# Altium schematic sheet 07-AUDIO_MAIN.SchDoc
size C
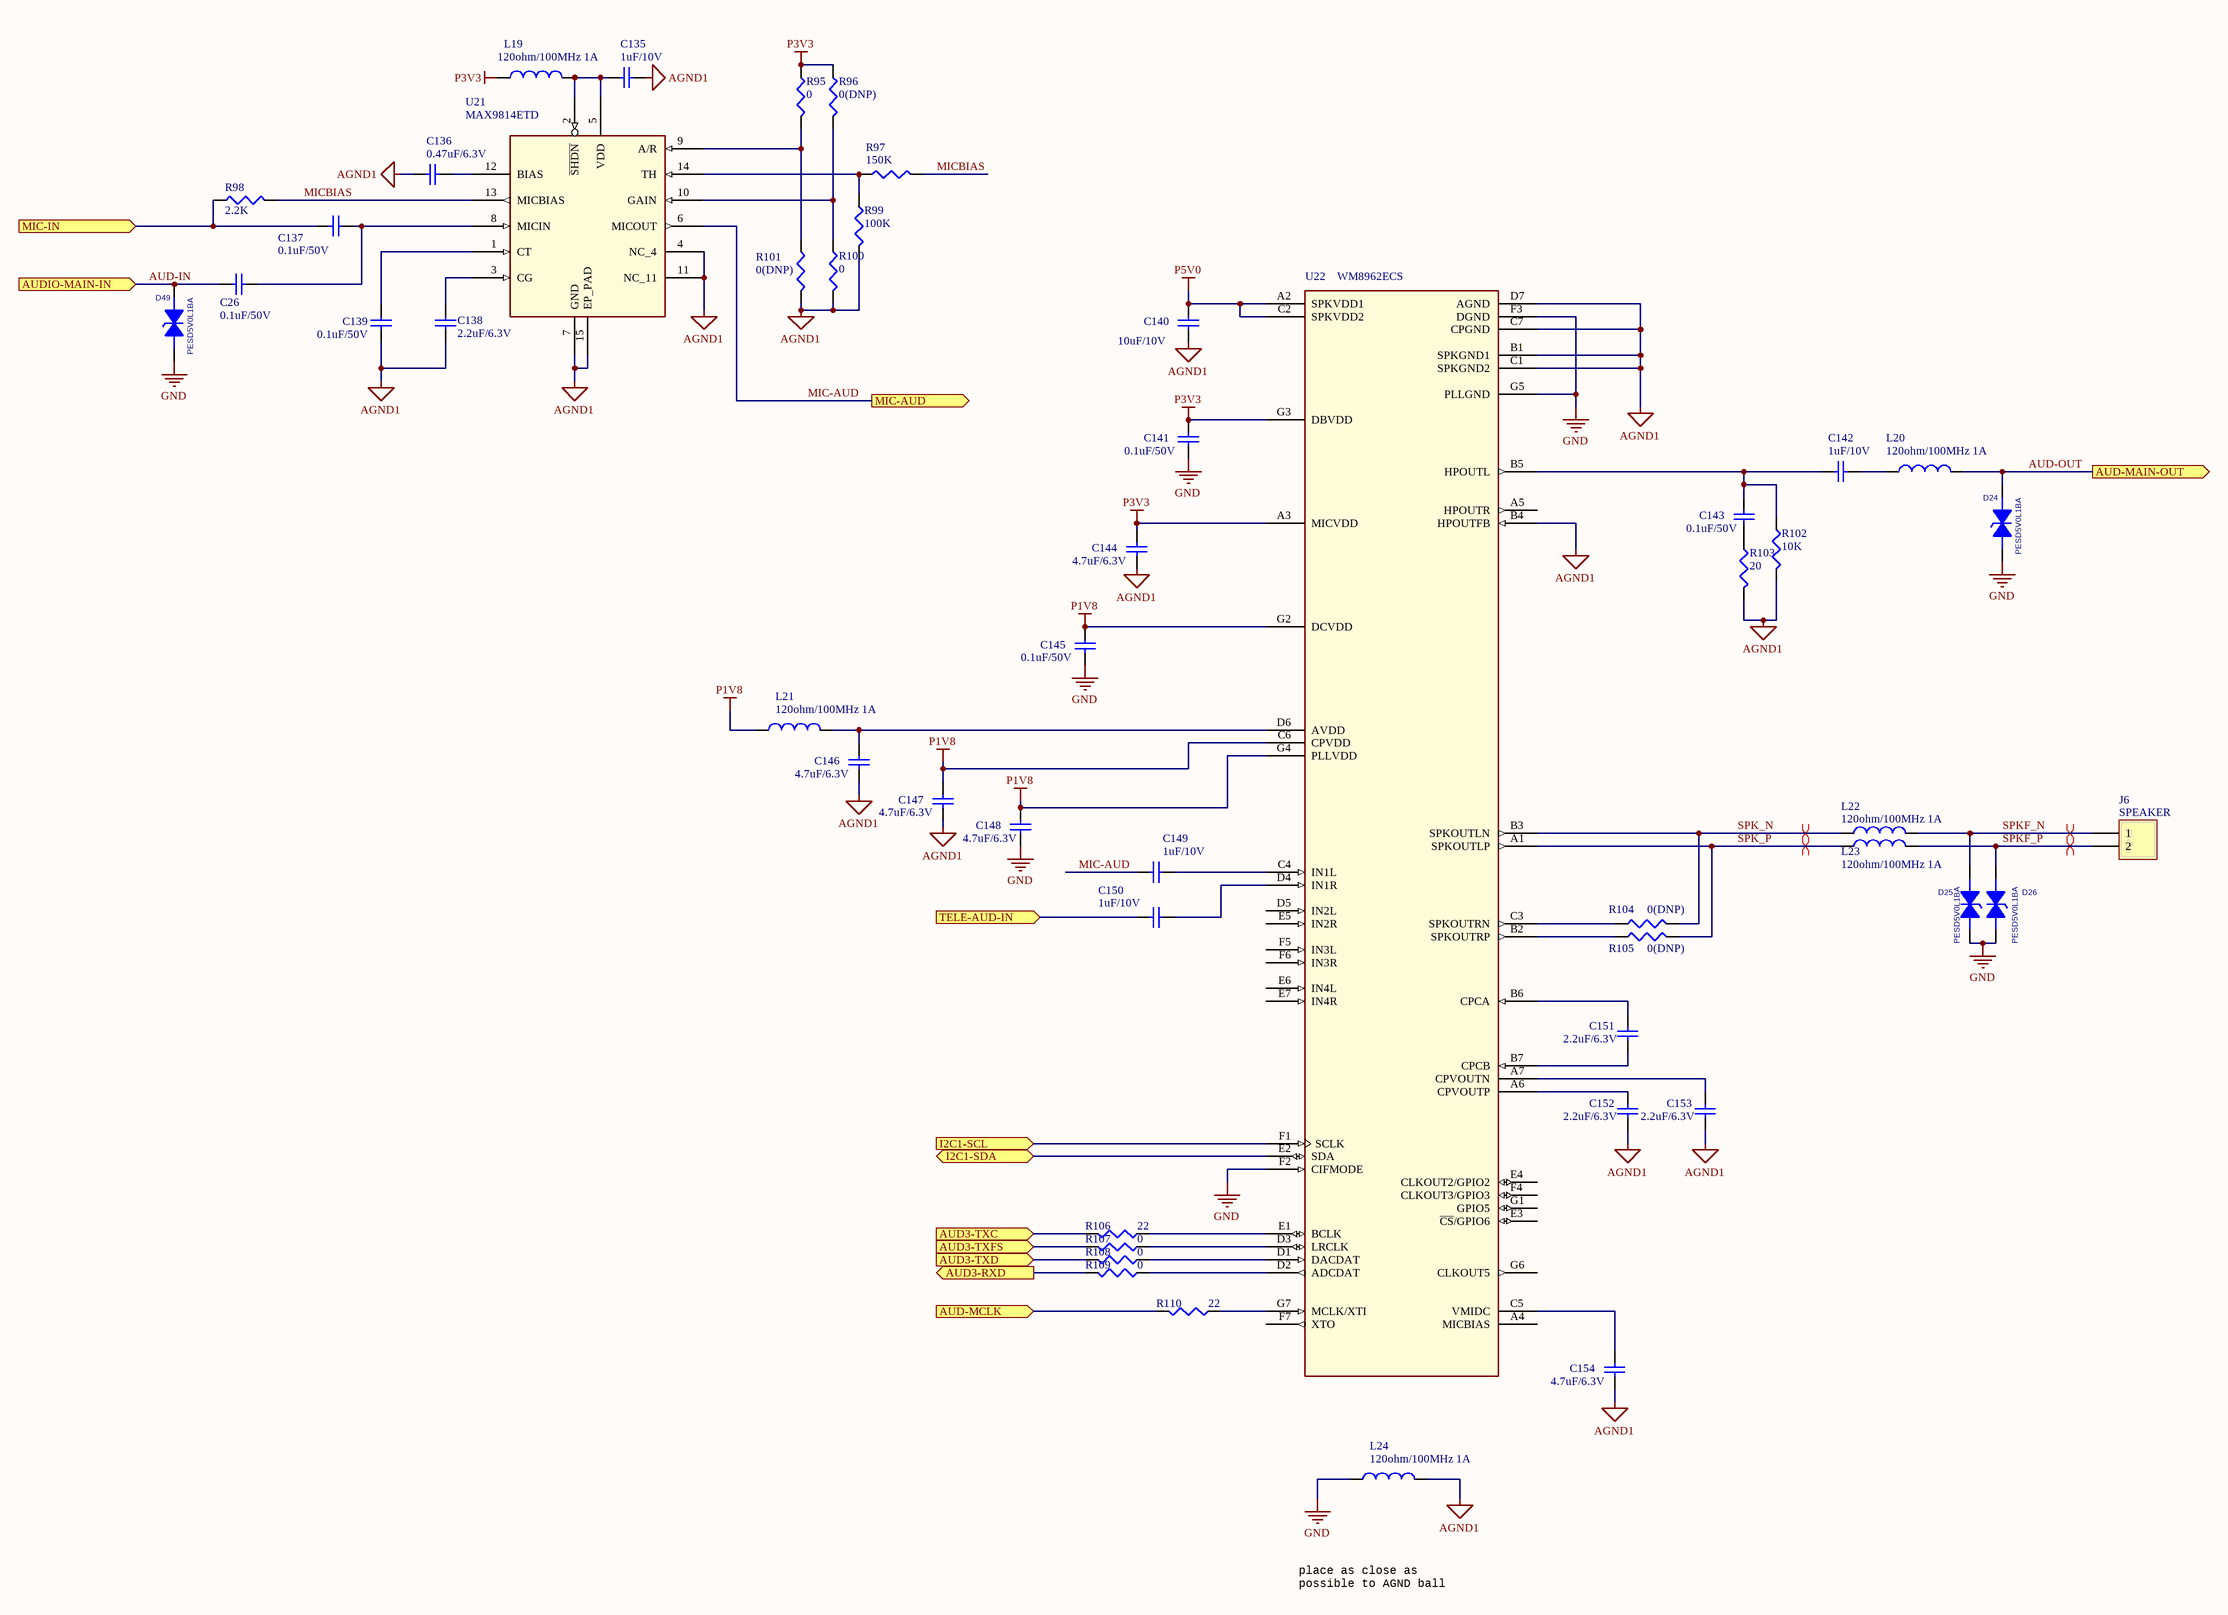
[diagram p0: 07-AUDIO_MAIN.SchDoc]

## Parts
C26  0.1uF/50V  [0402]
C135  1uF/10V  [0402]
C136  0.47uF/6.3V  [0402]
C137  0.1uF/50V  [0402]
C138  2.2uF/6.3V  [0402]
C139  0.1uF/50V  [0402]
C140  10uF/10V  [0805]
C141  0.1uF/50V  [0402]
C142  1uF/10V  [0402]
C143  0.1uF/50V  [0402]
C144  4.7uF/6.3V  [0603]
C145  0.1uF/50V  [0402]
C146  4.7uF/6.3V  [0603]
C147  4.7uF/6.3V  [0603]
C148  4.7uF/6.3V  [0603]
C149  1uF/10V  [0402]
C150  1uF/10V  [0402]
C151  2.2uF/6.3V  [0402]
C152  2.2uF/6.3V  [0402]
C153  2.2uF/6.3V  [0402]
C154  4.7uF/6.3V  [0603]
D24  PESD5V0L1BA  [SOD323]
D25  PESD5V0L1BA  [SOD323]
D26  PESD5V0L1BA  [SOD323]
D49  PESD5V0L1BA  [SOD323]
J6  SPEAKER  [1250WV-S-2P]
L19  120ohm/100MHz 1A  [0603]
L20  120ohm/100MHz 1A  [0603]
L21  120ohm/100MHz 1A  [0603]
L22  120ohm/100MHz 1A  [0603]
L23  120ohm/100MHz 1A  [0603]
L24  120ohm/100MHz 1A  [0603]
R95  0  [0402]
R96  0(DNP)  [0402]
R97  150K  [0402]
R98  2.2K  [0402]
R99  100K  [0402]
R100  0  [0402]
R101  0(DNP)  [0402]
R102  10K  [0402]
R103  20  [0402]
R104  0(DNP)  [0402]
R105  0(DNP)  [0402]
R106  22  [0402]
R107  0  [0402]
R108  0  [0402]
R109  0  [0402]
R110  22  [0402]
U21  MAX9814ETD  [TDFN14]
U22  WM8962ECS  [BGA49]

## Ports
AUD3-RXD (out), AUD3-TXC (in), AUD3-TXD (in), AUD3-TXFS (in), AUD-MAIN-OUT (out), AUD-MCLK (in), AUDIO-MAIN-IN (in), I2C1-SCL (in), I2C1-SDA (bidir), MIC-AUD (out), MIC-IN (in), TELE-AUD-IN (in)

## Nets
AGND1: C135.1 C136.2 C138.2 C139.2 C140.1 C144.1 C146.1 C147.1 C152.1 C153.1 C154.1 L24.2 R99.2 R100.2 R101.2 R102.2 R103.2 U21.4(NC_4) U21.7(GND) U21.11(NC_11) U21.15(EP_PAD) U22.B1(SPKGND1) U22.B4(HPOUTFB) U22.C1(SPKGND2) U22.C7(CPGND) U22.D7(AGND)
GND: C141.1 C145.1 C148.1 D24.1 D25.1 D26.1 D49.1 L24.1 U22.F2(CIFMODE) U22.F3(DGND) U22.G5(PLLGND)
P1V8: C145.2 C147.2 C148.2 L21.1 U22.C6(CPVDD) U22.G2(DCVDD) U22.G4(PLLVDD)
P3V3: C141.2 C144.2 L19.1 R95.1 R96.1 U22.A3(MICVDD) U22.G3(DBVDD)
P5V0: C140.2 U22.A2(SPKVDD1) U22.C2(SPKVDD2)
AUD3-RXD: R109.2 ; port AUD3-RXD
AUD3-TXC: R106.2 ; port AUD3-TXC
AUD3-TXD: R108.2 ; port AUD3-TXD
AUD3-TXFS: R107.2 ; port AUD3-TXFS
AUD-IN: C26.1 D49.2 ; port AUDIO-MAIN-IN
AUD-MCLK: R110.2 ; port AUD-MCLK
AUD-OUT: D24.2 L20.2 ; port AUD-MAIN-OUT
I2C1-SCL: U22.F1(SCLK) ; port I2C1-SCL
I2C1-SDA: U22.E2(SDA) ; port I2C1-SDA
MIC-AUD: C149.2 U21.6(MICOUT) ; port MIC-AUD
MIC-IN: C137.2 R98.1 ; port MIC-IN
MICBIAS: R97.2 R98.2 U21.13(MICBIAS)
SPK_N: L22.2 R104.2 U22.B3(SPKOUTLN)
SPK_P: L23.2 R105.2 U22.A1(SPKOUTLP)
SPKF_N: D25.2 J6.1 L22.1
SPKF_P: D26.2 J6.2 L23.1
TELE-AUD-IN: C150.2 ; port TELE-AUD-IN
NetC26_2: C26.2 C137.1 U21.8(MICIN)
NetC135_2: C135.2 L19.2 U21.2(~{SHDN}) U21.5(VDD)
NetC136_1: C136.1 U21.12(BIAS)
NetC138_1: C138.1 U21.3(CG)
NetC139_1: C139.1 U21.1(CT)
NetC142_1: C142.1 L20.1
NetC142_2: C142.2 C143.2 R102.1 U22.B5(HPOUTL)
NetC143_1: C143.1 R103.1
NetC146_2: C146.2 L21.2 U22.D6(AVDD)
NetC149_1: C149.1 U22.C4(IN1L)
NetC150_1: C150.1 U22.D4(IN1R)
NetC151_1: C151.1 U22.B7(CPCB)
NetC151_2: C151.2 U22.B6(CPCA)
NetC152_2: C152.2 U22.A6(CPVOUTP)
NetC153_2: C153.2 U22.A7(CPVOUTN)
NetC154_2: C154.2 U22.C5(VMIDC)
NetR95_2: R95.2 R101.1 U21.9(A/R)
NetR96_2: R96.2 R100.1 U21.10(GAIN)
NetR97_1: R97.1 R99.1 U21.14(TH)
NetR104_1: R104.1 U22.C3(SPKOUTRN)
NetR105_1: R105.1 U22.B2(SPKOUTRP)
NetR106_1: R106.1 U22.E1(BCLK)
NetR107_1: R107.1 U22.D3(LRCLK)
NetR108_1: R108.1 U22.D1(DACDAT)
NetR109_1: R109.1 U22.D2(ADCDAT)
NetR110_1: R110.1 U22.G7(MCLK/XTI)

Not connected (* = marked no-connect by the designer): U22 A4(MICBIAS) A5(HPOUTR) D5(IN2L) E3(~{CS}/GPIO6) E4(CLKOUT2/GPIO2) E5(IN2R) E6(IN4L) E7(IN4R) F4(CLKOUT3/GPIO3) F5(IN3L) F6(IN3R) F7(XTO) G1(GPIO5) G6(CLKOUT5)

## Layout directives
differential pair: SPK_N, SPK_P, SPKF_N, SPKF_P

## Notes on the sheet
- place as close as
  possible to AGND ball

## Library data of the parts
C26 C135-C154 = Cap: Capacitor; Published: 8-Jun-2000; LatestRevisionDate: 17-Jul-2002; LatestRevisionNote: Re-released for DXP Platform.; PackageReference: RAD-0.3; Publisher: Altium Limited; PackageDescription: Radial Cap, Thru-Hole; 2 Leads; 0.3 in Pin Spacing
D24-D26 D49 = PESD
J6 = Header 2: Header, 2-Pin; LatestRevisionDate: 17-Jul-2002; LatestRevisionNote: Re-released for DXP Platform.; Publisher: Altium Limited
L19-L24 = Inductor: Code_IEC: 1005; Value: 300ohm/100MHz BEAD; Published: 8-Jun-2000; LatestRevisionDate: 29-May-2009; LatestRevisionNote: IPC-7351 Footprint Added.; PackageReference: 0402-A; Publisher: Altium Limited; PackageDescription: Chip Inductor; Code_JEITA: 0402
R95-R110 = CR16-1003FM
U21 = MAX9814_TDFN14: IC LIN AGC AMP 2.7-5.5V TDFN14; CAD_APPROVED: Yes; MFG_PN01: MAX9814ETD+T; MFG_NAME01: MAXIM; AGILE_PN: 315-79082; CLASS: IC; HEIGHT: 0.8MM; ROHS: Yes
U22 = WM8962_BGA_49P_CUST: IC AUDIO CODEC 24BIT DAC 2 CH ADC 1.8V BGA49; AGILE_PN: 315-79434; MFG_NAME01: WOLFSON MICROELECTRONICS; MFG_PN01: WM8962ECSN/R; CAD_APPROVED: Yes; FPLIST: bga49_0p5_3p62x4,bga49_0p5_3p62x4_smdp; CLASS: IC; ROHS: Yes; HEIGHT: 0.75MM